# Altium project AudioDSP-v3.0.PrjPcb
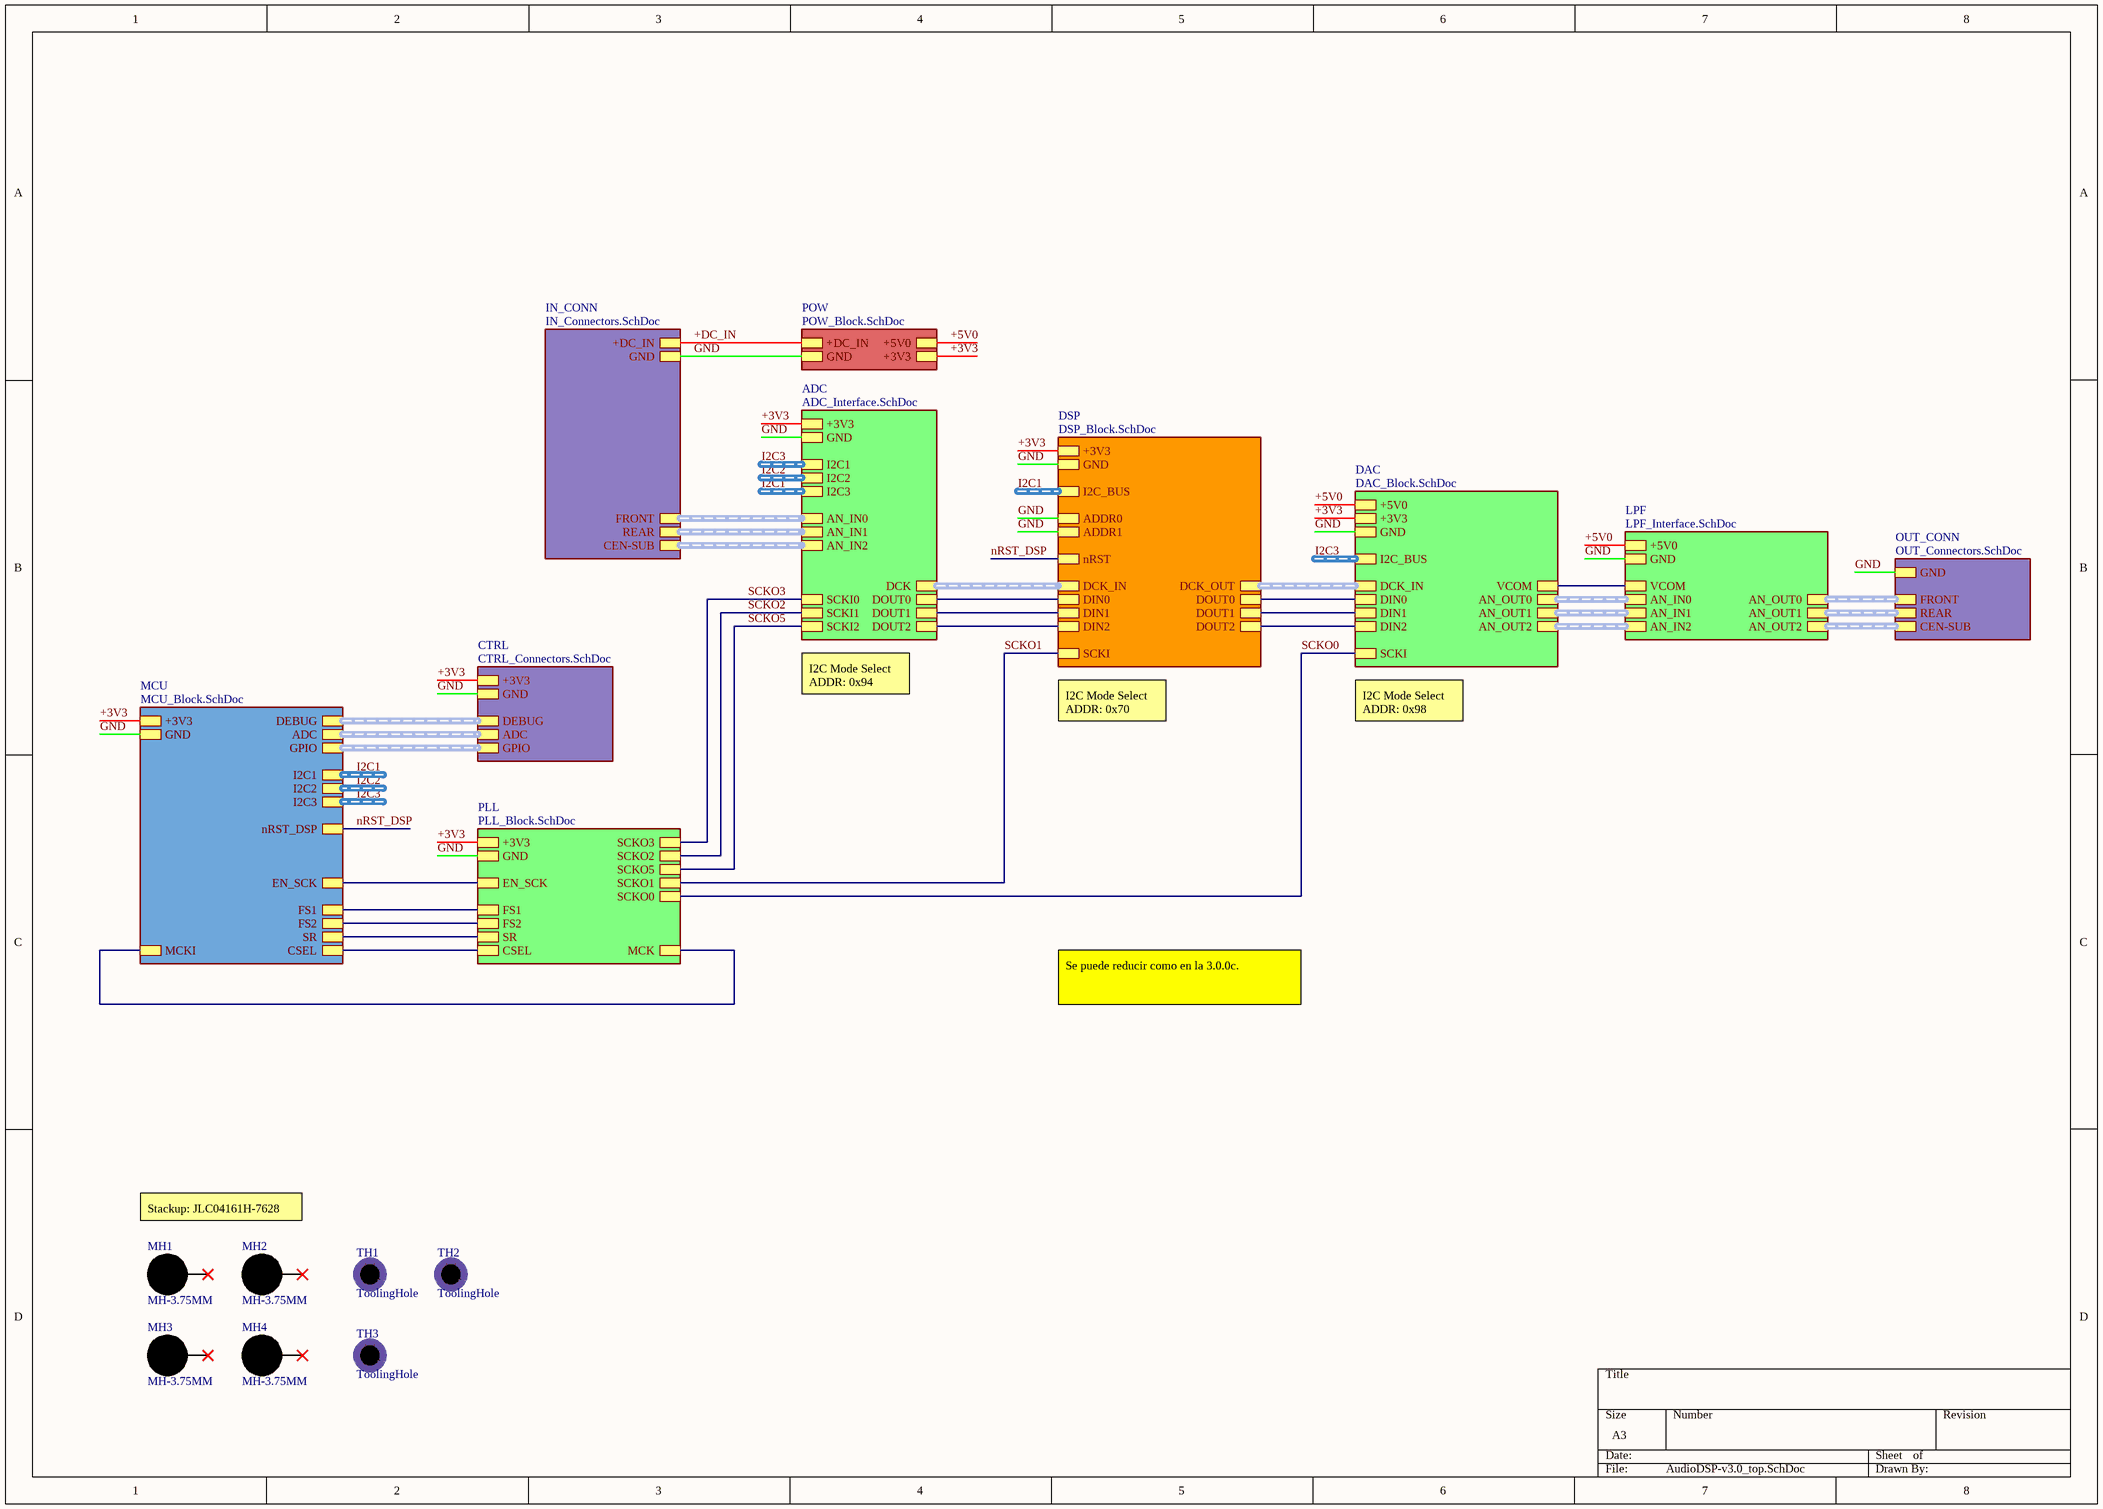
[diagram p0: AudioDSP-v3.0_top.SchDoc]
6 sheets, 81 parts. Net scope: hierarchical (ports join the sheet entries above them; power ports are global).
Board file: AudioDSP-3.0.PcbDoc
Sheets:
  AudioDSP-v3.0_top.SchDoc
    PLL = PLL_Block.SchDoc
    DAC = DAC_Block.SchDoc
    MCU = MCU_Block.SchDoc
    DSP = DSP_Block.SchDoc
  ADC_Block.SchDoc

## Sheet AudioDSP-v3.0_top.SchDoc
size A3; SheetNumber: 1; SheetTotal: 13

### Parts
MH1  MH-3.75MM  [MH-3.75mm-NP]  (no BOM)
MH2  MH-3.75MM  [MH-3.75mm-NP]  (no BOM)
MH3  MH-3.75MM  [MH-3.75mm-NP]  (no BOM)
MH4  MH-3.75MM  [MH-3.75mm-NP]  (no BOM)
TH1  ToolingHole  [TOOLING-HOLE]  (no BOM)
TH2  ToolingHole  [TOOLING-HOLE]  (no BOM)
TH3  ToolingHole  [TOOLING-HOLE]  (no BOM)

### Sub-sheets
ADC = ADC_Interface.SchDoc (file not in this document): +3V3, GND, I2C1 (harness I2C), AN_IN1 (harness AN), SCKI0, I2C2 (harness I2C), I2C3 (harness I2C), SCKI2, SCKI1, AN_IN2 (harness AN), AN_IN0 (harness AN), DCK (harness DCK), DOUT0, DOUT1, DOUT2
CTRL = CTRL_Connectors.SchDoc (file not in this document): DEBUG (harness SW), +3V3, GND, ADC (harness ADC), GPIO (harness GPIO)
DAC = DAC_Block.SchDoc: +3V3, GND, I2C_BUS (harness I2C), +5V0, VCOM, DIN0, DIN1, DIN2, DCK_IN (harness DCK), SCKI, AN_OUT0 (harness AN), AN_OUT1 (harness AN), AN_OUT2 (harness AN)
DSP = DSP_Block.SchDoc: +3V3, GND, SCKI, nRST, ADDR0, ADDR1, I2C_BUS (harness I2C), DCK_IN (harness DCK), DIN0, DIN1, DIN2, DCK_OUT (harness DCK), DOUT0, DOUT1, DOUT2
IN_CONN = IN_Connectors.SchDoc (file not in this document): +DC_IN, GND, FRONT (harness AN), REAR (harness AN), CEN-SUB (harness AN)
LPF = LPF_Interface.SchDoc (file not in this document): +5V0, GND, VCOM, AN_IN0 (harness AN), AN_IN1 (harness AN), AN_IN2 (harness AN), AN_OUT0 (harness AN), AN_OUT1 (harness AN), AN_OUT2 (harness AN)
MCU = MCU_Block.SchDoc: +3V3, GND, DEBUG (harness SW), ADC (harness ADC), I2C1 (harness I2C), I2C2 (harness I2C), I2C3 (harness I2C), MCKI, nRST_DSP, EN_SCK, FS1, FS2, SR, CSEL, GPIO (harness GPIO)
OUT_CONN = OUT_Connectors.SchDoc (file not in this document): FRONT (harness AN), REAR (harness AN), CEN-SUB (harness AN), GND
PLL = PLL_Block.SchDoc: +3V3, GND, FS1, FS2, SR, CSEL, MCK, EN_SCK, SCKO0, SCKO1, SCKO2, SCKO3, SCKO5
POW = POW_Block.SchDoc (file not in this document): +DC_IN, GND, +5V0, +3V3

### Nets
+3V3: sheet PLL/+3V3, sheet DAC/+3V3, sheet POW/+3V3, sheet MCU/+3V3, sheet CTRL/+3V3, sheet ADC/+3V3, sheet DSP/+3V3
+5V0: sheet DAC/+5V0, sheet POW/+5V0, sheet LPF/+5V0
+DC_IN: sheet POW/+DC_IN, sheet IN_CONN/+DC_IN
CSEL: sheet PLL/CSEL, sheet MCU/CSEL
EN_SCK: sheet PLL/EN_SCK, sheet MCU/EN_SCK
FS1: sheet PLL/FS1, sheet MCU/FS1
FS2: sheet PLL/FS2, sheet MCU/FS2
GND: sheet PLL/GND, sheet DAC/GND, sheet POW/GND, sheet IN_CONN/GND, sheet OUT_CONN/GND, sheet MCU/GND, sheet CTRL/GND, sheet ADC/GND, sheet LPF/GND, sheet DSP/GND, sheet DSP/ADDR0, sheet DSP/ADDR1
MCK: sheet PLL/MCK, sheet MCU/MCKI
nRST_DSP: sheet MCU/nRST_DSP, sheet DSP/nRST
SCKO0: sheet PLL/SCKO0, sheet DAC/SCKI
SCKO1: sheet PLL/SCKO1, sheet DSP/SCKI
SCKO2: sheet PLL/SCKO2, sheet ADC/SCKI1
SCKO3: sheet PLL/SCKO3, sheet ADC/SCKI0
SCKO5: sheet PLL/SCKO5, sheet ADC/SCKI2
SR: sheet PLL/SR, sheet MCU/SR
NetU1#2_6: sheet DAC/DIN0, sheet DSP/DOUT0
NetU1#2_11: sheet DAC/DIN1, sheet DSP/DOUT1
NetU1#2_12: sheet DAC/DIN2, sheet DSP/DOUT2
NetU1#4_59: sheet ADC/DOUT0, sheet DSP/DIN0
NetU1#4_62: sheet ADC/DOUT1, sheet DSP/DIN1
NetU1#4_67: sheet ADC/DOUT2, sheet DSP/DIN2
NetU2#2_1: sheet DAC/VCOM, sheet LPF/VCOM

Not connected (* = marked no-connect by the designer): MH1 1*; MH2 1*; MH3 1*; MH4 1*

### Buses and harness runs
harness I2C1 = sheet ADC/I2C3
harness I2C1 = sheet DSP/I2C_BUS
harness I2C1 = sheet MCU/I2C1
harness I2C2 = sheet ADC/I2C2
harness I2C2 = sheet MCU/I2C2
harness I2C3 = sheet ADC/I2C1
harness I2C3 = sheet DAC/I2C_BUS
harness I2C3 = sheet MCU/I2C3
harness sheet ADC/AN_IN0 = sheet IN_CONN/FRONT
harness sheet ADC/AN_IN1 = sheet IN_CONN/REAR
harness sheet ADC/AN_IN2 = sheet IN_CONN/CEN-SUB
harness sheet ADC/DCK = sheet DSP/DCK_IN
harness sheet CTRL/ADC = sheet MCU/ADC
harness sheet CTRL/DEBUG = sheet MCU/DEBUG
harness sheet CTRL/GPIO = sheet MCU/GPIO
harness sheet DAC/AN_OUT0 = sheet LPF/AN_IN0
harness sheet DAC/AN_OUT1 = sheet LPF/AN_IN1
harness sheet DAC/AN_OUT2 = sheet LPF/AN_IN2
harness sheet DAC/DCK_IN = sheet DSP/DCK_OUT
harness sheet LPF/AN_OUT0 = sheet OUT_CONN/FRONT
harness sheet LPF/AN_OUT1 = sheet OUT_CONN/REAR
harness sheet LPF/AN_OUT2 = sheet OUT_CONN/CEN-SUB

### Notes on the sheet
- I2C Mode Select
  ADDR: 0x94
- I2C Mode Select
  ADDR: 0x70
- I2C Mode Select
  ADDR: 0x98
- Se puede reducir como en la 3.0.0c.
- Stackup: JLC04161H-7628

### Library data of the parts
MH1-MH4 = MH-3.75MM: ClassName: MountHole
TH1-TH3 = ToolingHole: ClassName: Tooling

## Sheet PLL_Block.SchDoc
size A4; SheetNumber: 2; SheetTotal: 13
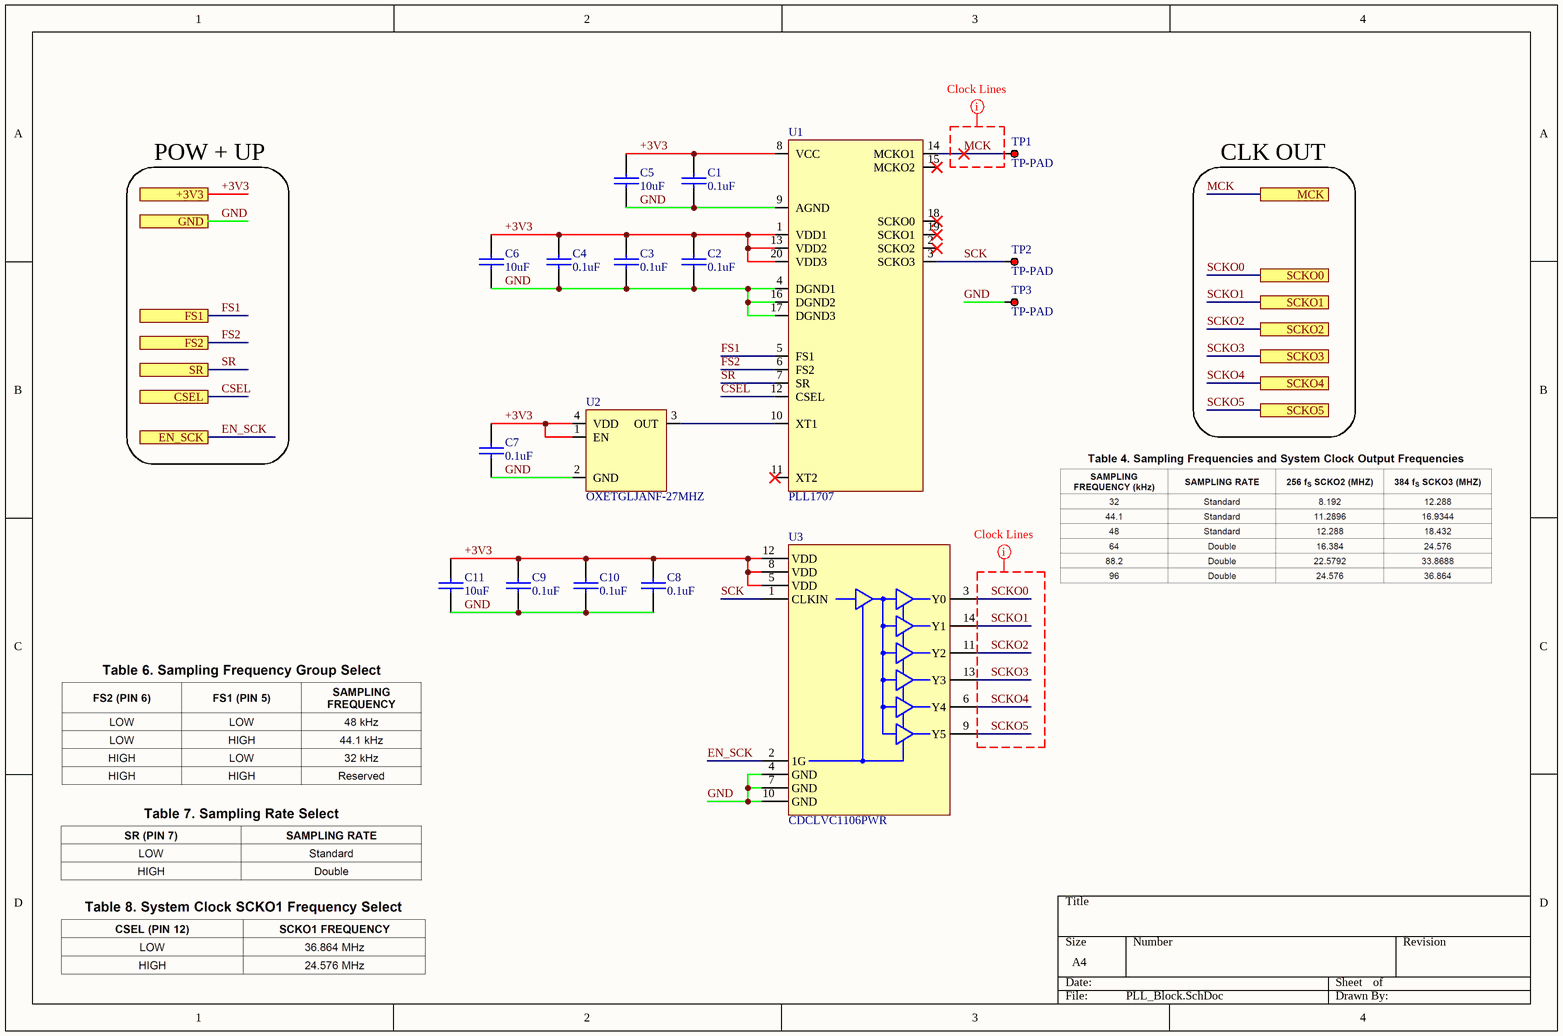
[diagram p1: PLL_Block.SchDoc]

### Parts
(Parts that share a designator on the sheet are numbered #1, #2 ... from top to bottom, then left to right.)
C1#1  0.1uF  [0402-CAP-TDK]
C2#1  0.1uF  [0402-CAP-TDK]
C3#1  0.1uF  [0402-CAP-TDK]
C4#1  0.1uF  [0402-CAP-TDK]
C5#1  10uF  [0603-CAP-TDK]
C6#1  10uF  [0603-CAP-TDK]
C7#1  0.1uF  [0402-CAP-TDK]
C8#1  0.1uF  [0402-CAP-TDK]
C9#1  0.1uF  [0402-CAP-TDK]
C10#1  0.1uF  [0402-CAP-TDK]
C11#1  10uF  [0603-CAP-TDK]
TP1  TP-PAD  [TPTH - PAD TOP]  (no BOM)
TP2  TP-PAD  [TPTH - PAD TOP]  (no BOM)
TP3  TP-PAD  [TPTH - PAD TOP]  (no BOM)
U1#1  PLL1707  [TI-SSOP-20 - DBQ (R-PDSO-G20)]
U2#1  OXETGLJANF-27MHZ  [SMD3225]
U3  CDCLVC1106PWR  [TI-TSSOP-14-PW0014A]

### Ports
+3V3 (see AudioDSP-v2.0_top[6B], ADC_Block[1A], ADC_Interface[1B], CTRL_Connectors[1A], DAC_Block[1B], DSP_Block[1A], MCU_Block[1A], POW_Block[4B]), CSEL (see AudioDSP-v2.0_top[6B], MCU_Block[4C]), EN_SCK (see AudioDSP-v2.0_top[6B], MCU_Block[4C]), FS1 (see AudioDSP-v2.0_top[6B], MCU_Block[4C]), FS2 (see AudioDSP-v2.0_top[6B], MCU_Block[4C]), GND (see AudioDSP-v2.0_top[6B], ADC_Block[1B], ADC_Interface[1B], CTRL_Connectors[1A], DAC_Block[1B], DSP_Block[1B], IN_Connectors[3A], LPF_Block[1B], LPF_Interface[1B], MCU_Block[1B], OUT_Connectors[3B], POW_Block[1B]), MCK (see AudioDSP-v2.0_top[6B]), SCKO0 (see AudioDSP-v2.0_top[6B]), SCKO1 (see AudioDSP-v2.0_top[6B]), SCKO2 (see AudioDSP-v2.0_top[6B]), SCKO3 (see AudioDSP-v2.0_top[6B]), SCKO4 (see AudioDSP-v2.0_top[6B]), SCKO5 (see AudioDSP-v2.0_top[6B]), SR (see AudioDSP-v2.0_top[6B], MCU_Block[4C])

### Nets
+3V3: C1#1.2 C2#1.2 C3#1.2 C4#1.2 C5#1.2 C6#1.2 C7#1.2 C8#1.2 C9#1.2 C10#1.2 C11#1.2 U1#1.1(VDD1) U1#1.8(VCC) U1#1.13(VDD2) U1#1.20(VDD3) U2#1.1(EN) U2#1.4(VDD) U3.5(VDD) U3.8(VDD) U3.12(VDD) ; port +3V3
CSEL: U1#1.12(CSEL) ; port CSEL
EN_SCK: U3.2(1G) ; port EN_SCK
FS1: U1#1.5(FS1) ; port FS1
FS2: U1#1.6(FS2) ; port FS2
GND: C1#1.1 C2#1.1 C3#1.1 C4#1.1 C5#1.1 C6#1.1 C7#1.1 C8#1.1 C9#1.1 C10#1.1 C11#1.1 TP3.1 U1#1.4(DGND1) U1#1.9(AGND) U1#1.16(DGND2) U1#1.17(DGND3) U2#1.2(GND) U3.4(GND) U3.7(GND) U3.10(GND) ; port GND
MCK: TP1.1 U1#1.14(MCKO1) ; port MCK
SCK: TP2.1 U1#1.3(SCKO3) U3.1(CLKIN)
SCKO0: U3.3(Y0) ; port SCKO0
SCKO1: U3.14(Y1) ; port SCKO1
SCKO2: U3.11(Y2) ; port SCKO2
SCKO3: U3.13(Y3) ; port SCKO3
SCKO4: U3.6(Y4) ; port SCKO4
SCKO5: U3.9(Y5) ; port SCKO5
SR: U1#1.7(SR) ; port SR
NetU1#1_10: U1#1.10(XT1) U2#1.3(OUT)

Not connected (* = marked no-connect by the designer): U1#1 2(SCKO2)* 11(XT2)* 15(MCKO2)* 18(SCKO0)* 19(SCKO1)*

### Layout directives
net class CLK: MCK, SCKO0, SCKO1, SCKO2, SCKO3, SCKO4, SCKO5

### Notes on the sheet
- POW + UP
- CLK OUT

### Library data of the parts
C1#1 C2#1 C3#1 C4#1 C5#1 C6#1 C7#1 C8#1 C9#1 C10#1 C11#1 = CAP-SMD
  C1#1 C2#1 C3#1 C4#1 C7#1 C8#1 C9#1 C10#1: JLCPart: C307331
  C5#1 C6#1 C11#1: JLCPart: C96446
U1#1 = PLL1707: Dual PLL Multi-Clock Generator; JLCPart: C1519963
U2#1 = OXETGLJANF-27MHZ: 3.3V ±50ppm 27MHz SMD3225-4P Oscillators; JLCPart: C295526
U3 = CDCLVC1106PWR: LVCMOS High-Performance Clock Buffer 6-Output; JLCPart: C56506

## Sheet DAC_Block.SchDoc
size A4; SheetNumber: 4; SheetTotal: 13
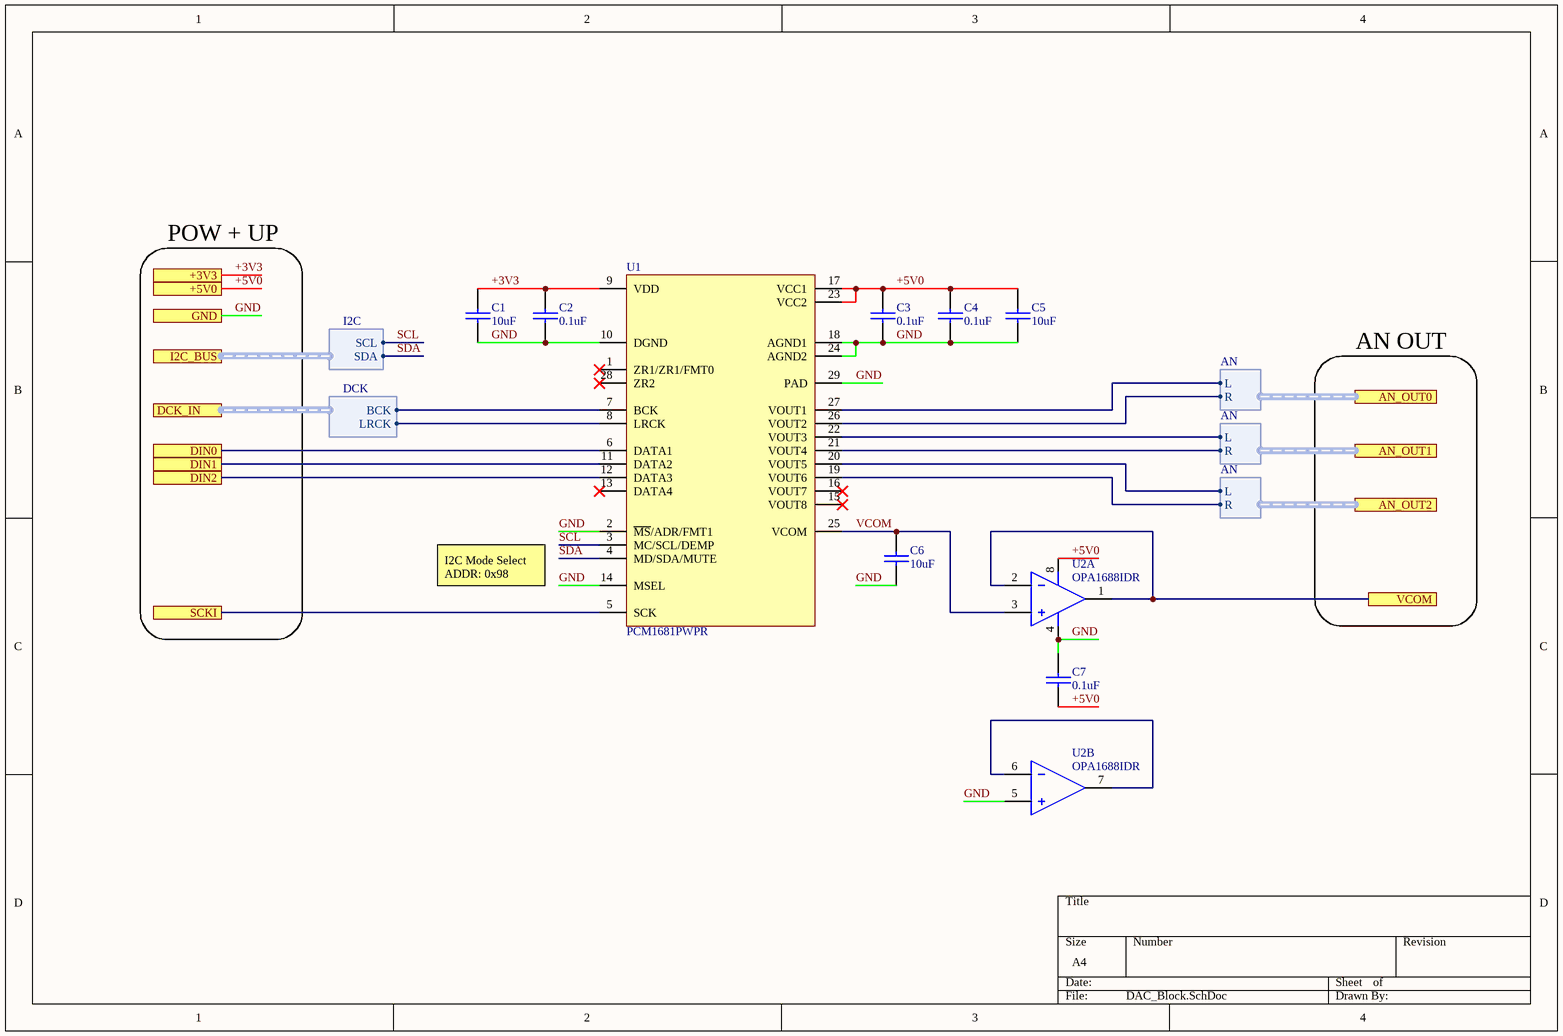
[diagram p2: DAC_Block.SchDoc]

### Parts
(Parts that share a designator on the sheet are numbered #1, #2 ... from top to bottom, then left to right.)
C1#2  10uF  [0603-CAP-TDK]
C2#2  0.1uF  [0402-CAP-TDK]
C3#2  0.1uF  [0402-CAP-TDK]
C4#2  0.1uF  [0402-CAP-TDK]
C5#2  10uF  [0603-CAP-TDK]
C6#2  10uF  [0603-CAP-TDK]
C7#2  0.1uF  [0402-CAP-TDK]
U1#2  PCM1681PWPR  [PCM1681PWPR]
U2#2  OPA1688IDR  [TI-SOIC-8]  (parts A,B of 2)

### Ports
+3V3 (see AudioDSP-v2.0_top[5C], ADC_Block[1A], ADC_Interface[1B], CTRL_Connectors[1A], DSP_Block[1A], MCU_Block[1A], PLL_Block[1A], POW_Block[4B]), +5V0 (see AudioDSP-v2.0_top[5C], LPF_Block[1B], LPF_Interface[1B], POW_Block[4B]), AN_OUT0 (harness AN, see AudioDSP-v2.0_top[6C]), AN_OUT1 (harness AN, see AudioDSP-v2.0_top[6C]), AN_OUT2 (harness AN, see AudioDSP-v2.0_top[6C]), DCK_IN (harness DCK, see AudioDSP-v2.0_top[5C]), DIN0 (see AudioDSP-v2.0_top[5C]), DIN1 (see AudioDSP-v2.0_top[5C]), DIN2 (see AudioDSP-v2.0_top[5C]), GND (see AudioDSP-v2.0_top[5C], ADC_Block[1B], ADC_Interface[1B], CTRL_Connectors[1A], DSP_Block[1B], IN_Connectors[3A], LPF_Block[1B], LPF_Interface[1B], MCU_Block[1B], OUT_Connectors[3B], PLL_Block[1A], POW_Block[1B]), I2C_BUS (harness I2C, see AudioDSP-v2.0_top[5C], ADC_Block[1B]), SCKI (see AudioDSP-v2.0_top[5C]), VCOM (see AudioDSP-v2.0_top[6C], LPF_Block[1C], LPF_Interface[1B])

### Harnesses
I2C: SCL, SDA
DCK: BCK, LRCK
AN: L, R

### Nets
+3V3: C1#2.2 C2#2.2 U1#2.9(VDD) ; port +3V3
+5V0: C3#2.2 C4#2.2 C5#2.2 C7#2.1 U1#2.17(VCC1) U1#2.23(VCC2) U2#2.8(VDD) ; port +5V0
GND: C1#2.1 C2#2.1 C3#2.1 C4#2.1 C5#2.1 C6#2.1 C7#2.2 U1#2.2(~{MS}/ADR/FMT1) U1#2.10(DGND) U1#2.14(MSEL) U1#2.18(AGND1) U1#2.24(AGND2) U1#2.29(PAD) U2#2.4(GND) U2#2.5(2IN+) ; port GND
SCKO0: U1#2.5(SCK) ; port SCKI
SCL: U1#2.3(MC/SCL/DEMP) ; port I2C_BUS.SCL  [project net I2C3.SCL]
SDA: U1#2.4(MD/SDA/MUTE) ; port I2C_BUS.SDA  [project net I2C3.SDA]
VCOM: C6#2.2 U1#2.25(VCOM) U2#2.3(1IN+)
NetU1#2_6: U1#2.6(DATA1) ; port DIN0
NetU1#2_7: U1#2.7(BCK) ; port DCK_IN.BCK
NetU1#2_8: U1#2.8(LRCK) ; port DCK_IN.LRCK
NetU1#2_11: U1#2.11(DATA2) ; port DIN1
NetU1#2_12: U1#2.12(DATA3) ; port DIN2
NetU1#2_19: U1#2.19(VOUT6) ; port AN_OUT2.R
NetU1#2_20: U1#2.20(VOUT5) ; port AN_OUT2.L
NetU1#2_21: U1#2.21(VOUT4) ; port AN_OUT1.R
NetU1#2_22: U1#2.22(VOUT3) ; port AN_OUT1.L
NetU1#2_26: U1#2.26(VOUT2) ; port AN_OUT0.R
NetU1#2_27: U1#2.27(VOUT1) ; port AN_OUT0.L
NetU2#2_1: U2#2.1(1OUT) U2#2.2(1IN-) ; port VCOM
NetU2#2_6: U2#2.6(2IN-) U2#2.7(2OUT)

Not connected (* = marked no-connect by the designer): U1#2 1(ZR1/ZR1/FMT0)* 13(DATA4)* 15(VOUT8)* 16(VOUT7)* 28(ZR2)*

### Notes on the sheet
- POW + UP
- AN OUT
- I2C Mode Select
  ADDR: 0x98

### Library data of the parts
C1#2 C2#2 C3#2 C4#2 C5#2 C6#2 C7#2 = CAP-SMD
  C1#2 C5#2 C6#2: JLCPart: C96446
  C2#2 C3#2 C4#2 C7#2: JLCPart: C307331
U2#2 = OPA1688IDR: Rail-To-Rail Amplifier 2 Circuit - 8-SOIC; JLCPart: C206212
U1#2 = PCM1681PWPR: JLCPart: C181571

## Sheet MCU_Block.SchDoc
size A4; SheetNumber: 8; SheetTotal: 13
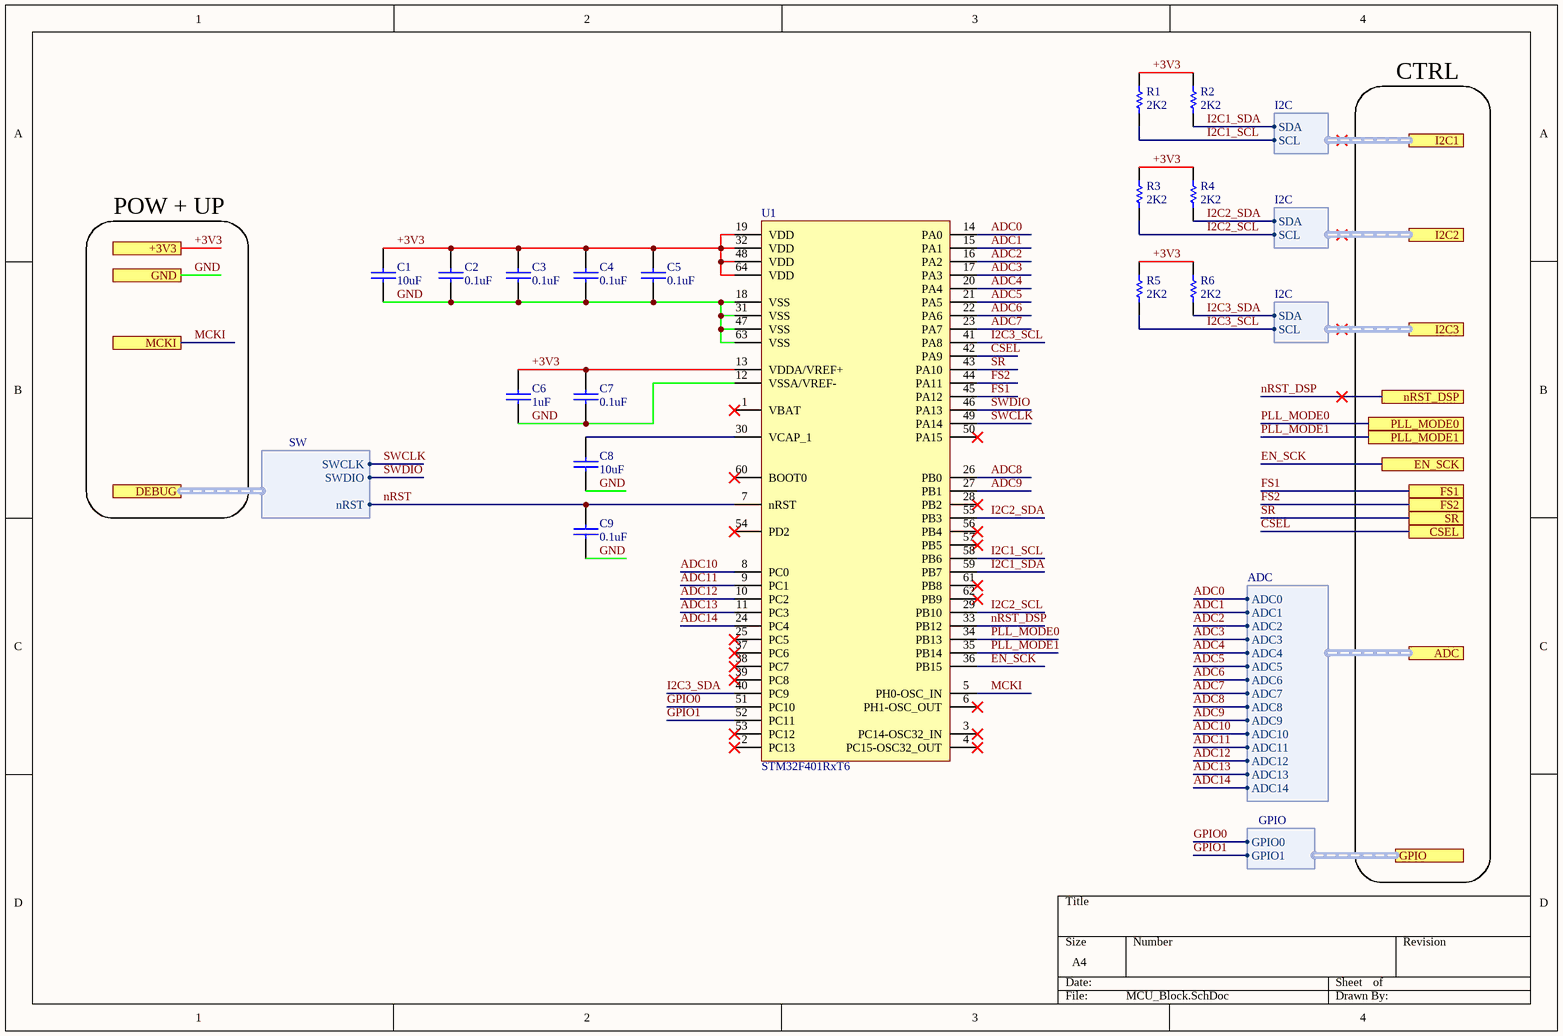
[diagram p3: MCU_Block.SchDoc]

### Parts
(Parts that share a designator on the sheet are numbered #1, #2 ... from top to bottom, then left to right.)
C1#3  10uF  [0603-CAP-TDK]
C2#3  0.1uF  [0402-CAP-TDK]
C3#3  0.1uF  [0402-CAP-TDK]
C4#3  0.1uF  [0402-CAP-TDK]
C5#3  0.1uF  [0402-CAP-TDK]
C6#3  1uF  [0603-CAP-TDK]
C7#3  0.1uF  [0402-CAP-TDK]
C8#2  10uF  [0603-CAP-TDK]
C9#2  0.1uF  [0402-CAP-TDK]
R1#1  2K2  [0402-RES-PANASONIC]
R2#1  2K2  [0402-RES-PANASONIC]
R3#1  2K2  [0402-RES-PANASONIC]
R4#1  2K2  [0402-RES-PANASONIC]
R5  2K2  [0402-RES-PANASONIC]
R6  2K2  [0402-RES-PANASONIC]
U1#3  STM32F401RxT6  [LQFP-64]

### Ports
+3V3 (see AudioDSP-v2.0_top[4A], ADC_Block[1A], ADC_Interface[1B], CTRL_Connectors[1A], DAC_Block[1B], DSP_Block[1A], PLL_Block[1A], POW_Block[4B]), ADC (harness ADC, see AudioDSP-v2.0_top[5A], CTRL_Connectors[1B]), CSEL (see AudioDSP-v2.0_top[5B], PLL_Block[1B]), DEBUG (harness SW, see AudioDSP-v2.0_top[5A], CTRL_Connectors[1B]), EN_SCK (see AudioDSP-v2.0_top[5B], PLL_Block[1B]), FS1 (see AudioDSP-v2.0_top[5B], PLL_Block[1B]), FS2 (see AudioDSP-v2.0_top[5B], PLL_Block[1B]), GND (see AudioDSP-v2.0_top[4A], ADC_Block[1B], ADC_Interface[1B], CTRL_Connectors[1A], DAC_Block[1B], DSP_Block[1B], IN_Connectors[3A], LPF_Block[1B], LPF_Interface[1B], OUT_Connectors[3B], PLL_Block[1A], POW_Block[1B]), GPIO (harness GPIO), I2C1 (harness I2C, see AudioDSP-v2.0_top[5A]), I2C2 (harness I2C, see AudioDSP-v2.0_top[5B], ADC_Interface[1B]), I2C3 (harness I2C, see AudioDSP-v2.0_top[5B]), MCKI (see AudioDSP-v2.0_top[4B]), nRST_DSP (see AudioDSP-v2.0_top[5B]), PLL_MODE0 (see AudioDSP-v2.0_top[5B], DSP_Block[1C]), PLL_MODE1 (see AudioDSP-v2.0_top[5B], DSP_Block[1C]), SR (see AudioDSP-v2.0_top[5B], PLL_Block[1B])

### Harnesses
SW: SWCLK, SWDIO, nRST
ADC: ADC0, ADC1, ADC2, ADC3, ADC4, ADC5, ADC6, ADC7, ADC8, ADC9, ADC10, ADC11, ADC12, ADC13, ADC14
I2C: SCL, SDA
GPIO: GPIO0, GPIO1

### Nets
+3V3: C1#3.2 C2#3.2 C3#3.2 C4#3.2 C5#3.2 C6#3.2 C7#3.2 R1#1.2 R2#1.2 R3#1.2 R4#1.2 R5.2 R6.2 U1#3.13(VDDA/VREF+) U1#3.19(VDD) U1#3.32(VDD) U1#3.48(VDD) U1#3.64(VDD) ; port +3V3
ADC0: U1#3.14(PA0) ; port ADC.ADC0
ADC1: U1#3.15(PA1) ; port ADC.ADC1
ADC2: U1#3.16(PA2) ; port ADC.ADC2
ADC3: U1#3.17(PA3) ; port ADC.ADC3
ADC4: U1#3.20(PA4) ; port ADC.ADC4
ADC5: U1#3.21(PA5) ; port ADC.ADC5
ADC6: U1#3.22(PA6) ; port ADC.ADC6
ADC7: U1#3.23(PA7) ; port ADC.ADC7
ADC8: U1#3.26(PB0) ; port ADC.ADC8
ADC9: U1#3.27(PB1) ; port ADC.ADC9
ADC10: U1#3.8(PC0) ; port ADC.ADC10
ADC11: U1#3.9(PC1) ; port ADC.ADC11
ADC12: U1#3.10(PC2) ; port ADC.ADC12
ADC13: U1#3.11(PC3) ; port ADC.ADC13
ADC14: U1#3.24(PC4) ; port ADC.ADC14
CSEL: U1#3.42(PA9) ; port CSEL
EN_SCK: U1#3.36(PB15) ; port EN_SCK
FS1: U1#3.45(PA12) ; port FS1
FS2: U1#3.44(PA11) ; port FS2
GND: C1#3.1 C2#3.1 C3#3.1 C4#3.1 C5#3.1 C6#3.1 C7#3.1 C8#2.1 C9#2.1 U1#3.12(VSSA/VREF-) U1#3.18(VSS) U1#3.31(VSS) U1#3.47(VSS) U1#3.63(VSS) ; port GND
GPIO0: U1#3.51(PC10) ; port GPIO.GPIO0
GPIO1: U1#3.52(PC11) ; port GPIO.GPIO1
I2C1_SCL: R1#1.1 U1#3.58(PB6) ; port I2C1.SCL  [project net I2C1.SCL]
I2C1_SDA: R2#1.1 U1#3.59(PB7) ; port I2C1.SDA  [project net I2C1.SDA]
I2C2_SCL: R3#1.1 U1#3.29(PB10) ; port I2C2.SCL  [project net I2C2.SCL]
I2C2_SDA: R4#1.1 U1#3.55(PB3) ; port I2C2.SDA  [project net I2C2.SDA]
I2C3_SCL: R5.1 U1#3.41(PA8) ; port I2C3.SCL  [project net I2C3.SCL]
I2C3_SDA: R6.1 U1#3.40(PC9) ; port I2C3.SDA  [project net I2C3.SDA]
MCKI: U1#3.5(PH0-OSC_IN) ; port MCKI  [project net MCK]
nRST: C9#2.2 U1#3.7(nRST) ; port DEBUG.nRST
nRST_DSP: U1#3.33(PB12) ; port nRST_DSP
PLL_MODE0: U1#3.34(PB13) ; port PLL_MODE0
PLL_MODE1: U1#3.35(PB14) ; port PLL_MODE1
SR: U1#3.43(PA10) ; port SR
SWCLK: U1#3.49(PA14) ; port DEBUG.SWCLK
SWDIO: U1#3.46(PA13) ; port DEBUG.SWDIO
NetC8#2_2: C8#2.2 U1#3.30(VCAP_1)

Not connected (* = marked no-connect by the designer): U1#3 1(VBAT)* 2(PC13)* 3(PC14-OSC32_IN)* 4(PC15-OSC32_OUT)* 6(PH1-OSC_OUT)* 25(PC5)* 28(PB2)* 37(PC6)* 38(PC7)* 39(PC8)* 50(PA15)* 53(PC12)* 54(PD2)* 56(PB4)* 57(PB5)* 60(BOOT0)* 61(PB8)* 62(PB9)*

### Notes on the sheet
- CTRL
- POW + UP

### Library data of the parts
C1#3 C2#3 C3#3 C4#3 C5#3 C6#3 C7#3 C8#2 C9#2 = CAP-SMD
  C1#3 C8#2: JLCPart: C96446
  C2#3 C3#3 C4#3 C5#3 C7#3 C9#2: JLCPart: C307331
  C6#3: JLCPart: C15849
R1#1 R2#1 R3#1 R4#1 R5 R6 = RES-SMD: JLCPart: C25879
U1#3 = STM32F401RxT6: JLCPart: C74524

## Sheet DSP_Block.SchDoc
size A4; SheetNumber: 13; SheetTotal: 13
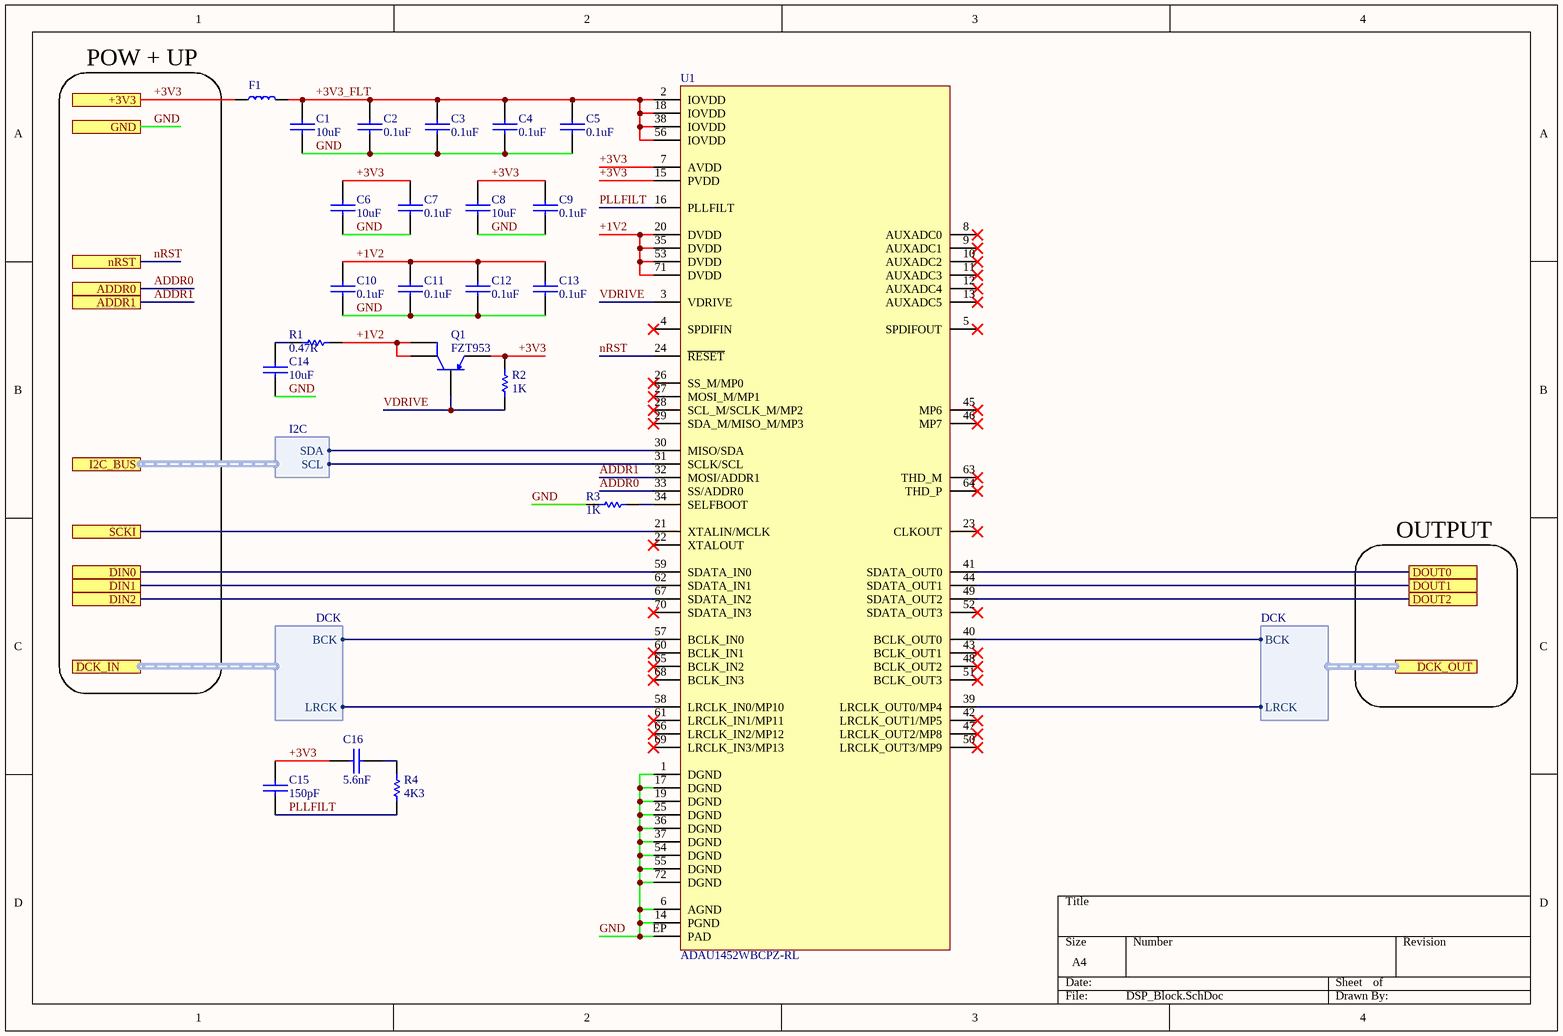
[diagram p4: DSP_Block.SchDoc]

### Parts
(Parts that share a designator on the sheet are numbered #1, #2 ... from top to bottom, then left to right.)
C1#4  10uF  [0603-CAP-TDK]
C2#4  0.1uF  [0402-CAP-TDK]
C3#4  0.1uF  [0402-CAP-TDK]
C4#4  0.1uF  [0402-CAP-TDK]
C5#4  0.1uF  [0402-CAP-TDK]
C6#4  10uF  [0603-CAP-TDK]
C7#4  0.1uF  [0402-CAP-TDK]
C8#3  10uF  [0603-CAP-TDK]
C9#3  0.1uF  [0402-CAP-TDK]
C10#2  0.1uF  [0402-CAP-TDK]
C11#2  0.1uF  [0402-CAP-TDK]
C12  0.1uF  [0402-CAP-TDK]
C13  0.1uF  [0402-CAP-TDK]
C14  10uF  [0603-CAP-TDK]
C15  150pF  [0402-CAP-TDK]
C16  5.6nF  [0402-CAP-TDK]
F1  YI201209U301-2R0T  [0805-IND]  (value not drawn)
Q1  FZT953  [SOT223-DN]
R1#2  0.47R  [0805-RES-PANASONIC]
R2#2  1K  [0402-RES-PANASONIC]
R3#2  1K  [0402-RES-PANASONIC]
R4#2  4K3  [0402-RES-PANASONIC]
U1#4  ADAU1452WBCPZ-RL  [LFCSP-VQ-72]

### Ports
+3V3 (see AudioDSP-v3.0_top[5B], ADC_Block[1A], ADC_Interface[1B], CTRL_Connectors[1A], DAC_Block[1B], MCU_Block[1A], PLL_Block[1A], POW_Block[4B]), ADDR0 (see AudioDSP-v3.0_top[5B]), ADDR1 (see AudioDSP-v3.0_top[5B]), DCK_IN (harness DCK, see AudioDSP-v3.0_top[5B]), DCK_OUT (harness DCK, see AudioDSP-v3.0_top[5B]), DIN0 (see AudioDSP-v3.0_top[5B]), DIN1 (see AudioDSP-v3.0_top[5B]), DIN2 (see AudioDSP-v3.0_top[5B]), DOUT0 (see AudioDSP-v3.0_top[5B]), DOUT1 (see AudioDSP-v3.0_top[5B]), DOUT2 (see AudioDSP-v3.0_top[5B]), GND (see AudioDSP-v3.0_top[5B], ADC_Block[1B], ADC_Interface[1B], CTRL_Connectors[1A], DAC_Block[1B], IN_Connectors[3A], LPF_Block[1B], LPF_Interface[1B], MCU_Block[1B], OUT_Connectors[3B], PLL_Block[1A], POW_Block[1B]), I2C_BUS (harness I2C, see AudioDSP-v3.0_top[5B], ADC_Block[1B]), nRST (see AudioDSP-v3.0_top[5B]), SCKI (see AudioDSP-v3.0_top[5B])

### Harnesses
I2C: SCL, SDA
DCK: BCK, LRCK

### Nets
+1V2: C10#2.2 C11#2.2 C12.2 C13.2 Q1.C Q1.C-TAB R1#2.1 U1#4.20(DVDD) U1#4.35(DVDD) U1#4.53(DVDD) U1#4.71(DVDD)
+3V3: C6#4.2 C7#4.2 C8#3.2 C9#3.2 C15.2 C16.2 F1.2 Q1.E R2#2.2 U1#4.7(AVDD) U1#4.15(PVDD) ; port +3V3
+3V3_FLT: C1#4.2 C2#4.2 C3#4.2 C4#4.2 C5#4.2 F1.1 U1#4.2(IOVDD) U1#4.18(IOVDD) U1#4.38(IOVDD) U1#4.56(IOVDD)
GND: C1#4.1 C2#4.1 C3#4.1 C4#4.1 C5#4.1 C6#4.1 C7#4.1 C8#3.1 C9#3.1 C10#2.1 C11#2.1 C12.1 C13.1 C14.1 R3#2.2 U1#4.1(DGND) U1#4.6(AGND) U1#4.14(PGND) U1#4.17(DGND) U1#4.19(DGND) U1#4.25(DGND) U1#4.32(MOSI/ADDR1) U1#4.33(SS/ADDR0) U1#4.36(DGND) U1#4.37(DGND) U1#4.54(DGND) U1#4.55(DGND) U1#4.72(DGND) U1#4.EP(PAD) ; port GND, port ADDR0, port ADDR1  [also labelled ADDR0, ADDR1]
I2C1.SCL: U1#4.31(SCLK/SCL) ; port I2C_BUS.SCL
I2C1.SDA: U1#4.30(MISO/SDA) ; port I2C_BUS.SDA
nRST: U1#4.24(~{RESET}) ; port nRST  [project net nRST_DSP]
PLLFILT: C15.1 R4#2.1 U1#4.16(PLLFILT)
SCKO1: U1#4.21(XTALIN/MCLK) ; port SCKI
VDRIVE: Q1.B R2#2.1 U1#4.3(VDRIVE)
NetC14_2: C14.2 R1#2.2
NetC16_1: C16.1 R4#2.2
NetR3#2_1: R3#2.1 U1#4.34(SELFBOOT)
NetU1#2_6: U1#4.41(SDATA_OUT0) ; port DOUT0
NetU1#2_7: U1#4.40(BCLK_OUT0) ; port DCK_OUT.BCK
NetU1#2_8: U1#4.39(LRCLK_OUT0/MP4) ; port DCK_OUT.LRCK
NetU1#2_11: U1#4.44(SDATA_OUT1) ; port DOUT1
NetU1#2_12: U1#4.49(SDATA_OUT2) ; port DOUT2
NetU1#4_57: U1#4.57(BCLK_IN0) ; port DCK_IN.BCK
NetU1#4_58: U1#4.58(LRCLK_IN0/MP10) ; port DCK_IN.LRCK
NetU1#4_59: U1#4.59(SDATA_IN0) ; port DIN0
NetU1#4_62: U1#4.62(SDATA_IN1) ; port DIN1
NetU1#4_67: U1#4.67(SDATA_IN2) ; port DIN2

Not connected (* = marked no-connect by the designer): U1#4 4(SPDIFIN)* 5(SPDIFOUT)* 8(AUXADC0)* 9(AUXADC1)* 10(AUXADC2)* 11(AUXADC3)* 12(AUXADC4)* 13(AUXADC5)* 22(XTALOUT)* 23(CLKOUT)* 26(SS_M/MP0)* 27(MOSI_M/MP1)* 28(SCL_M/SCLK_M/MP2)* 29(SDA_M/MISO_M/MP3)* 42(LRCLK_OUT1/MP5)* 43(BCLK_OUT1)* 45(MP6)* 46(MP7)* 47(LRCLK_OUT2/MP8)* 48(BCLK_OUT2)* 50(LRCLK_OUT3/MP9)* 51(BCLK_OUT3)* 52(SDATA_OUT3)* 60(BCLK_IN1)* 61(LRCLK_IN1/MP11)* 63(THD_M)* 64(THD_P)* 65(BCLK_IN2)* 66(LRCLK_IN2/MP12)* 68(BCLK_IN3)* 69(LRCLK_IN3/MP13)* 70(SDATA_IN3)*

### Notes on the sheet
- POW + UP
- OUTPUT

### Library data of the parts
C1#4 C2#4 C3#4 C4#4 C5#4 C6#4 C7#4 C8#3 C9#3 C10#2 C11#2 C12-C16 = CAP-SMD
  C1#4 C6#4 C8#3 C14: JLCPart: C96446
  C2#4 C3#4 C4#4 C5#4 C7#4 C9#3 C10#2 C11#2 C12 C13: JLCPart: C307331
  C15: JLCPart: C363511
  C16: JLCPart: C527017
F1 = YI201209U301-2R0T: 100mΩ ±25% 300Ω@100MHz 0805; JLCPart: C2858467
R1#2 R2#2 R3#2 R4#2 = RES-SMD
  R1#2: JLCPart: C308364
  R2#2 R3#2: JLCPart: C11702
  R4#2: JLCPart: C517692
U1#4 = ADAU1452WBCPZ-RL: SigmaDSP 294.912 MHz, 32-bit Audio Processor; JLCPart: C462188

## Sheet ADC_Block.SchDoc
size A4; SheetNumber: 11; SheetTotal: 13
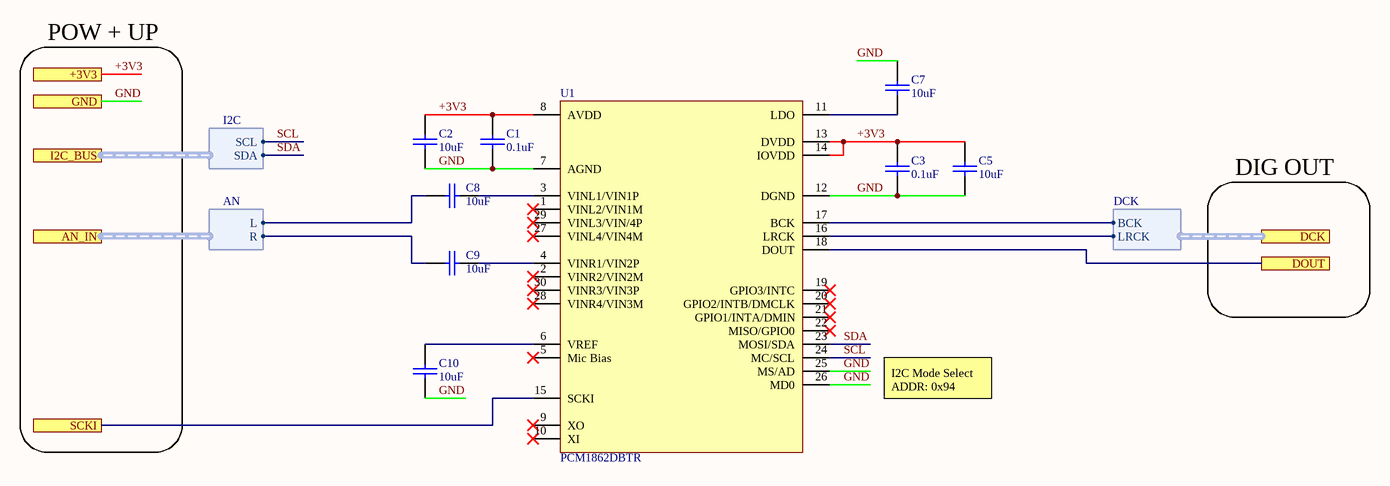
[diagram p5: ADC_Block.SchDoc]

### Parts
(Parts that share a designator on the sheet are numbered #1, #2 ... from top to bottom, then left to right.)
C1#5  0.1uF  [0402-CAP-TDK]
C2#5  10uF  [0603-CAP-TDK]
C3#5  0.1uF  [0402-CAP-TDK]
C5#5  10uF  [0603-CAP-TDK]
C7#5  10uF  [0603-CAP-TDK]
C8#4  10uF  [0603-CAP-TDK]
C9#4  10uF  [0603-CAP-TDK]
C10#3  10uF  [0603-CAP-TDK]
U1#5  PCM1862DBTR  [TI-TSSOP-30-DBT0030A]

### Ports
+3V3 (see ADC_Interface[2B], ADC_Interface[1B], CTRL_Connectors[1A], DAC_Block[1B], DSP_Block[1A], MCU_Block[1A], PLL_Block[1A], POW_Block[4B]), AN_IN (harness AN, see ADC_Interface[2B]), DCK (harness DCK, see ADC_Interface[3B], ADC_Interface[4B]), DOUT (see ADC_Interface[3B]), GND (see ADC_Interface[2B], ADC_Interface[1B], CTRL_Connectors[1A], DAC_Block[1B], DSP_Block[1B], IN_Connectors[3A], LPF_Block[1B], LPF_Interface[1B], MCU_Block[1B], OUT_Connectors[3B], PLL_Block[1A], POW_Block[1B]), I2C_BUS (harness I2C, see ADC_Interface[2B], DAC_Block[1B]), SCKI (see ADC_Interface[2B])

### Harnesses
I2C: SCL, SDA
AN: L, R
DCK: BCK, LRCK

### Nets
+3V3: C1#5.2 C2#5.2 C3#5.2 C5#5.2 U1#5.8(AVDD) U1#5.13(DVDD) U1#5.14(IOVDD) ; port +3V3
GND: C1#5.1 C2#5.1 C3#5.1 C5#5.1 C7#5.2 C10#3.1 U1#5.7(AGND) U1#5.12(DGND) U1#5.25(MS/AD) U1#5.26(MD0) ; port GND
SCL: U1#5.24(MC/SCL) ; port I2C_BUS.SCL
SDA: U1#5.23(MOSI/SDA) ; port I2C_BUS.SDA
NetC7#5_1: C7#5.1 U1#5.11(LDO)
NetC8#4_1: C8#4.1 U1#5.3(VINL1/VIN1P)
NetC8#4_2: C8#4.2 ; port AN_IN.L
NetC9#4_1: C9#4.1 U1#5.4(VINR1/VIN2P)
NetC9#4_2: C9#4.2 ; port AN_IN.R
NetC10#3_2: C10#3.2 U1#5.6(VREF)
NetU1#5_15: U1#5.15(SCKI) ; port SCKI
NetU1#5_16: U1#5.16(LRCK) ; port DCK.LRCK
NetU1#5_17: U1#5.17(BCK) ; port DCK.BCK
NetU1#5_18: U1#5.18(DOUT) ; port DOUT

Not connected (* = marked no-connect by the designer): U1#5 1(VINL2/VIN1M)* 2(VINR2/VIN2M)* 5(Mic_Bias)* 9(XO)* 10(XI)* 19(GPIO3/INTC)* 20(GPIO2/INTB/DMCLK)* 21(GPIO1/INTA/DMIN)* 22(MISO/GPIO0)* 27(VINL4/VIN4M)* 28(VINR4/VIN3M)* 29(VINL3/VIN/4P)* 30(VINR3/VIN3P)*

### Notes on the sheet
- POW + UP
- DIG OUT
- I2C Mode Select
  ADDR: 0x94

### Library data of the parts
C1#5 C2#5 C3#5 C5#5 C7#5 C8#4 C9#4 C10#3 = CAP-SMD
  C1#5 C3#5: JLCPart: C307331
  C2#5 C5#5 C7#5 C8#4 C9#4 C10#3: JLCPart: C96446
U1#5 = PCM1862DBTR: JLCPart: C544647

## Nets that join several sheets
+3V3: PLL_Block (20 pins), DAC_Block (C1#2.2 C2#2.2 U1#2.9), MCU_Block (18 pins), DSP_Block (11 pins)
CSEL: PLL_Block (U1#1.12), MCU_Block (U1#3.42)
EN_SCK: PLL_Block (U3.2), MCU_Block (U1#3.36)
FS1: PLL_Block (U1#1.5), MCU_Block (U1#3.45)
FS2: PLL_Block (U1#1.6), MCU_Block (U1#3.44)
GND: PLL_Block (20 pins), DAC_Block (15 pins), MCU_Block (14 pins), DSP_Block (29 pins)
I2C1.SCL: MCU_Block (R1#1.1 U1#3.58), DSP_Block (U1#4.31)
I2C1.SDA: MCU_Block (R2#1.1 U1#3.59), DSP_Block (U1#4.30)
I2C3.SCL: DAC_Block (U1#2.3), MCU_Block (R5.1 U1#3.41)
I2C3.SDA: DAC_Block (U1#2.4), MCU_Block (R6.1 U1#3.40)
MCK: PLL_Block (TP1.1 U1#1.14), MCU_Block (U1#3.5)
NetU1#2_6: DAC_Block (U1#2.6), DSP_Block (U1#4.41)
NetU1#2_7: DAC_Block (U1#2.7), DSP_Block (U1#4.40)
NetU1#2_8: DAC_Block (U1#2.8), DSP_Block (U1#4.39)
NetU1#2_11: DAC_Block (U1#2.11), DSP_Block (U1#4.44)
NetU1#2_12: DAC_Block (U1#2.12), DSP_Block (U1#4.49)
nRST_DSP: MCU_Block (U1#3.33), DSP_Block (U1#4.24)
SCKO0: PLL_Block (U3.3), DAC_Block (U1#2.5)
SCKO1: PLL_Block (U3.14), DSP_Block (U1#4.21)
SR: PLL_Block (U1#1.7), MCU_Block (U1#3.43)

## Assembly variants
For Assembly: not fitted J1 J1_CTRL J2 J2_CTRL J3 J3_CTRL J4 J4_CTRL J5 J5_CTRL J6 J6_CTRL J7 J7_CTRL J8 J8_CTRL J9_CTRL J10_CTRL J11_CTRL J12_CTRL J12A_CTRL J12B_CTRL U1_POW U2_POW